# EAGLE design apu_mega_shield_integradted (EAGLE 6.5.0)

## Sheet 1 of 2
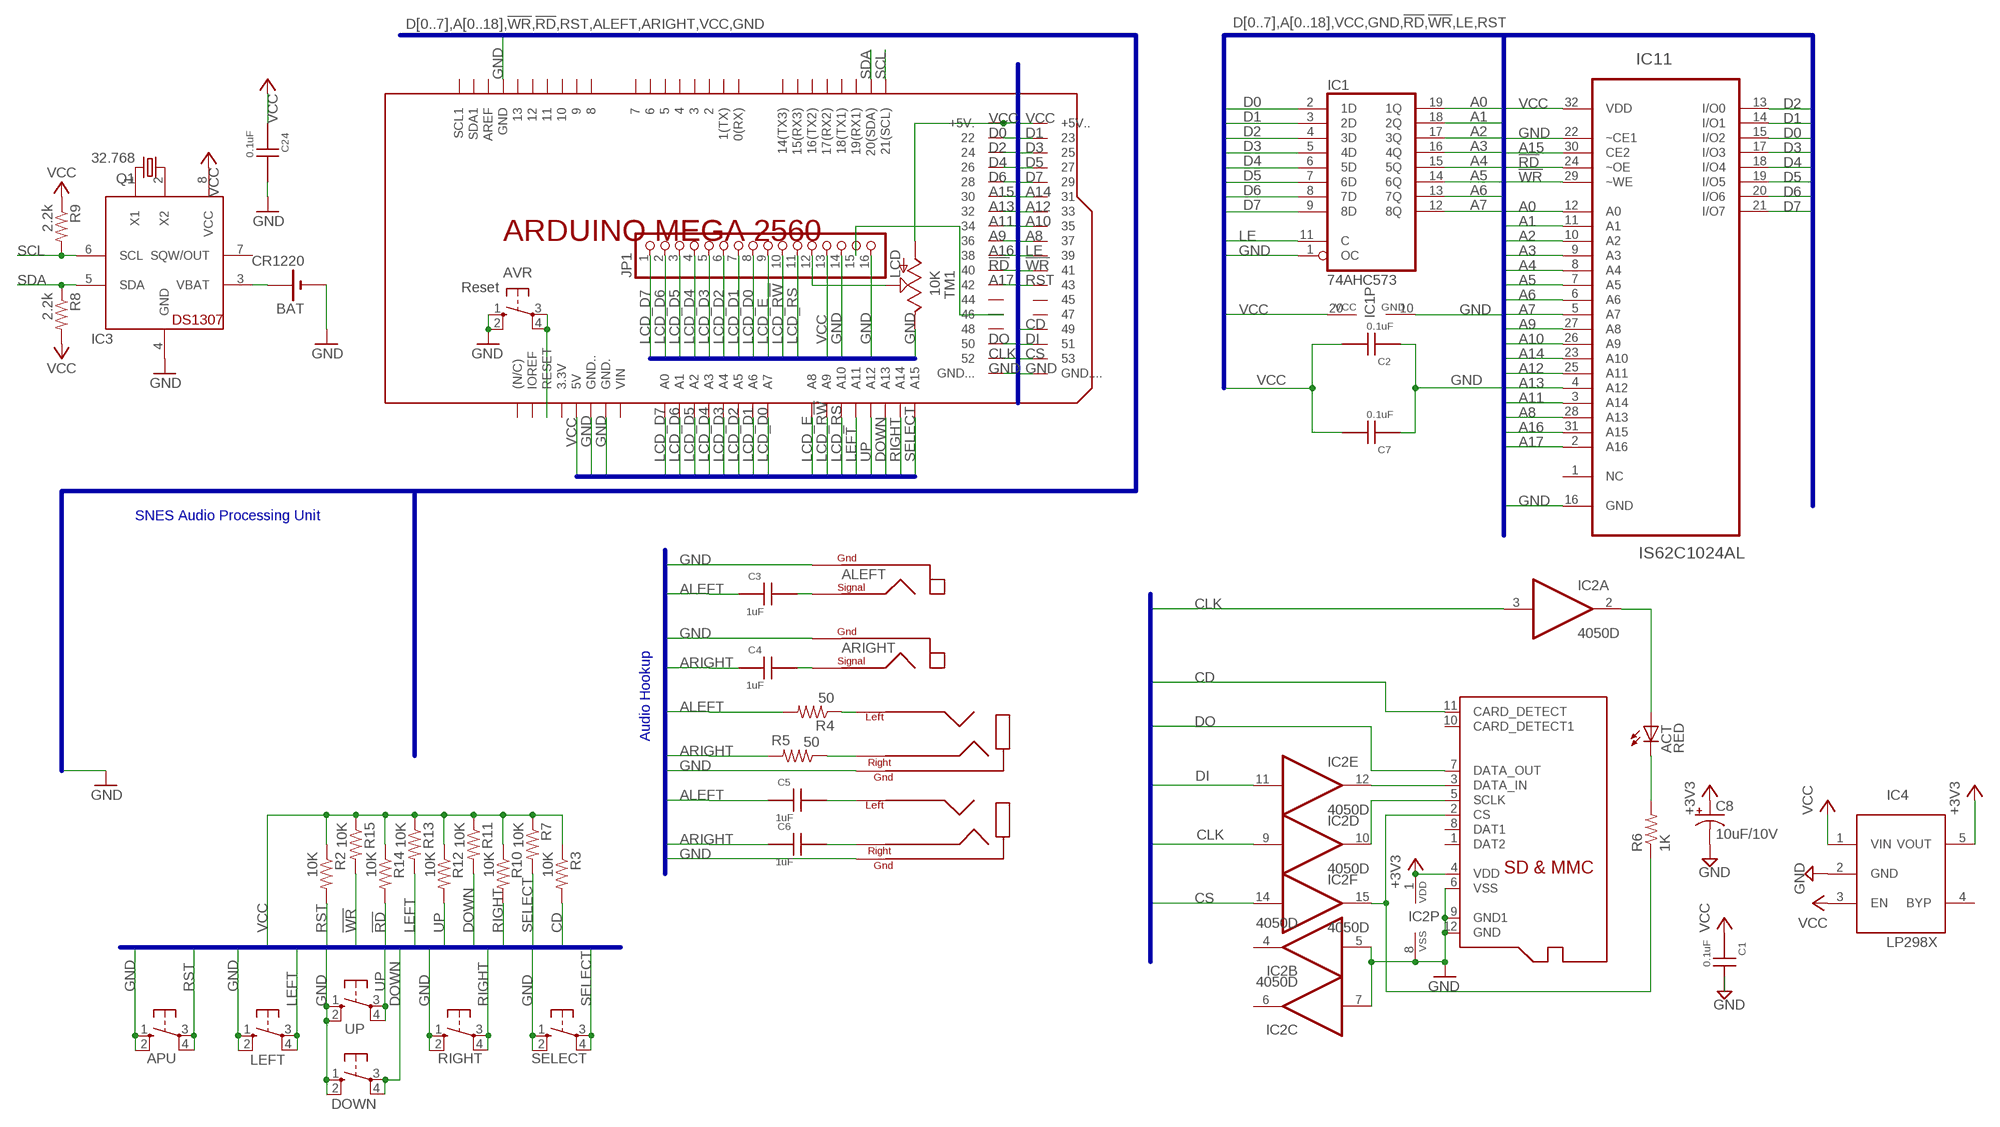
[diagram p0: schematic, sheet 1]

### Parts
ACT  RED  LEDCHIP-LED0805  [CHIP-LED0805]
APU  Reset  10-XX  [B3F-10XX]
AVR  Reset  10-XX  [B3F-10XX]
BAT  CR1220  CR1220SMT  [CR1220-SMD]
C1  0.1uF  C0805  [C0805]
C2  0.1uF  C0805  [C0805]
C3  1uF  C0805  [C0805]
C4  1uF  C0805  [C0805]
C5  1uF  C0805  [C0805]
C6  1uF  C0805  [C0805]
C7  0.1uF  C0805  [C0805]
C8  10uF/10V  CPOL-USA/3216-18R  [A/3216-18R]
C24  0.1uF  C0805  [C0805]
DOWN  DOWN  10-XX  [B3F-10XX]
IC1  74AHC573  74HCT573D  [SO20W]
IC2  4050D  [SO16]
IC3  DS1307  DS1307SMT  [SO-08]
IC4  LP298XS  [SOT23-5L]
IC11  IS62C1024AL  IS62C1024AL-35QLI  [SOIC127P1412X305-32N]
JP1  LCD  PINHD-1X16  [1X16]
LEFT  LEFT  10-XX  [B3F-10XX]
Q1  32.768  CRYTALSMD  [SMD]
R2  10K  R-US_R0805  [R0805]
R3  10K  R-US_R0805  [R0805]
R4  50  R-US_R0805  [R0805]
R5  50  R-US_R0805  [R0805]
R6  1K  R-US_R0805  [R0805]
R7  10K  R-US_R0805  [R0805]
R8  2.2k  R-US_R0805  [R0805]
R9  2.2k  R-US_R0805  [R0805]
R10  10K  R-US_R0805  [R0805]
R11  10K  R-US_R0805  [R0805]
R12  10K  R-US_R0805  [R0805]
R13  10K  R-US_R0805  [R0805]
R14  10K  R-US_R0805  [R0805]
R15  10K  R-US_R0805  [R0805]
RIGHT  RIGHT  10-XX  [B3F-10XX]
SELECT  SELECT  10-XX  [B3F-10XX]
TM1  10K  TRIM_US-CA6H  [CA6H]
U$2  HEADPHONE  [SJ1-3533N]
U$3  HEADPHONE  [SJ1-3533N]
U$4  RCA  [RCJ-01X]
U$5  RCA  [RCJ-01X]
U$6  ARDUINO_MEGA_2560_LITENO_LABELS  [ARDUINO_MEGA2560_LITE_NO_LABELS]
UP  UP  10-XX  [B3F-10XX]
X1  MICROSDMOLEX  [MICROSD-1]

### Nets
!RD: IC11.24(~OE) R14.2 U$6.40 ; also sheet 2
!WR: IC11.29(~WE) R15.2 U$6.41 ; also sheet 2
+3V3 [supply]: C8.+ IC2.1(P:VDD) IC4.5(VOUT) X1.4(VDD)
A0: IC1.19(1Q) IC11.12(A0)
A1: IC1.18(2Q) IC11.11(A1)
A2: IC1.17(3Q) IC11.10(A2)
A3: IC1.16(4Q) IC11.9(A3)
A4: IC1.15(5Q) IC11.8(A4)
A5: IC1.14(6Q) IC11.7(A5)
A6: IC1.13(7Q) IC11.6(A6)
A7: IC1.12(8Q) IC11.5(A7)
A8: IC11.28(A13) U$6.37
A9: IC11.27(A8) U$6.36
A10: IC11.26(A9) U$6.35 ; also sheet 2
A11: IC11.3(A14) U$6.34 ; also sheet 2
A12: IC11.25(A11) U$6.33
A13: IC11.4(A12) U$6.32
A14: IC11.23(A10) U$6.31
A15: IC11.30(CE2) U$6.30 ; also sheet 2
A16: IC11.31(A15) U$6.38
A17: IC11.2(A16) U$6.42
ALEFT [audio]: C3.1 C5.1 R4.2 ; also sheet 2
ARIGHT [audio]: C4.1 C6.1 R5.2 ; also sheet 2
BUF_CLK: IC2.10(D:O) X1.5(SCLK)
BUF_CS: IC2.15(F:O) R6.1 X1.2(CS)
BUF_DI: IC2.12(E:O) X1.3(DATA_IN)
BUF_LED: ACT.A IC2.2(A:O)
CD: R3.2 U$6.49 X1.11(CARD_DETECT)
CLK: IC2.3(A:I) IC2.9(D:I) U$6.52
CS: IC2.14(F:I) U$6.53
D0: IC1.2(1D) IC11.15(I/O2) U$6.22 ; also sheet 2
D1: IC1.3(2D) IC11.14(I/O1) U$6.23 ; also sheet 2
D2: IC1.4(3D) IC11.13(I/O0) U$6.24 ; also sheet 2
D3: IC1.5(4D) IC11.17(I/O3) U$6.25 ; also sheet 2
D4: IC1.6(5D) IC11.18(I/O4) U$6.26 ; also sheet 2
D5: IC1.7(6D) IC11.19(I/O5) U$6.27 ; also sheet 2
D6: IC1.8(7D) IC11.20(I/O6) U$6.28 ; also sheet 2
D7: IC1.9(8D) IC11.21(I/O7) U$6.29 ; also sheet 2
DI: IC2.11(E:I) U$6.51
DO: U$6.50 X1.7(DATA_OUT)
DOWN: DOWN.3(P) DOWN.4(P1) R11.2 U$6.A13
GND [supply]: APU.1(S) APU.2(S1) AVR.1(S) AVR.2(S1) BAT.- C1.2 C2.1 C7.1 C8.- C24.2 DOWN.1(S) DOWN.2(S1) IC1.1(OC) IC1.10(GND) IC2.5(B:I) IC2.7(C:I) IC2.8(P:VSS) IC3.4(GND) IC4.2(GND) IC11.16(GND) IC11.22(~CE1) JP1.14 JP1.16 LEFT.1(S) LEFT.2(S1) RIGHT.1(S) RIGHT.2(S1) SELECT.1(S) SELECT.2(S1) TM1.E U$2.GND U$3.GND U$4.PGND1 U$4.PGND2 U$4.PGND3 U$5.PGND1 U$5.PGND2 U$5.PGND3 U$6.GND U$6.GND. U$6.GND.. U$6.GND... U$6.GND.... UP.1(S) UP.2(S1) X1.6(VSS) X1.9(GND1) X1.12(GND) ; also sheet 2
LCD_D0: JP1.8 U$6.A7
LCD_D1: JP1.7 U$6.A6
LCD_D2: JP1.6 U$6.A5
LCD_D3: JP1.5 U$6.A4
LCD_D4: JP1.4 U$6.A3
LCD_D5: JP1.3 U$6.A2
LCD_D6: JP1.2 U$6.A1
LCD_D7: JP1.1 U$6.A0
LCD_E: JP1.9 U$6.A8
LCD_R!W: JP1.10 U$6.A9
LCD_RS: JP1.11 U$6.A10
LE: IC1.11(C) U$6.39
LEFT: LEFT.3(P) LEFT.4(P1) R13.2 U$6.A11
N$1: AVR.3(P) AVR.4(P1) U$6.RESET
N$2 [audio]: C3.2 U$4.PSIG
N$3 [audio]: C4.2 U$5.PSIG
N$4 [audio]: C5.2 U$3.LEFT
N$8 [audio]: C6.2 U$3.RIGHT
N$9 [audio]: R4.1 U$2.LEFT
N$10 [audio]: R5.1 U$2.RIGHT
N$11: ACT.C R6.2
N$13 [supply]: JP1.12 TM1.S
N$15: BAT.+$1(+) BAT.+$2(+) IC3.3(VBAT)
N$21: IC3.1(X1) Q1.2
N$22: IC3.2(X2) Q1.1
PWM: JP1.15 U$6.46
RIGHT: R10.2 RIGHT.3(P) RIGHT.4(P1) U$6.A14
RST: APU.3(P) APU.4(P1) R2.2 U$6.43 ; also sheet 2
SCL: IC3.6(SCL) R9.2 U$6.21(21(SCL))
SDA: IC3.5(SDA) R8.1 U$6.20(20(SDA))
SELECT: R7.2 SELECT.3(P) SELECT.4(P1) U$6.A15
UP: R12.2 U$6.A12 UP.3(P) UP.4(P1)
VCC [supply]: C1.1 C2.2 C7.2 C24.1 IC1.20(VCC) IC3.8(VCC) IC4.1(VIN) IC4.3(EN) IC11.32(VDD) JP1.13 R2.1 R3.1 R7.1 R8.2 R9.1 R10.1 R11.1 R12.1 R13.1 R14.1 R15.1 TM1.A U$6.5V U$6.5V.(+5V.) U$6.5V..(+5V..) ; also sheet 2
Unconnected: IC2.4(B:O) IC2.6(C:O) IC3.7(SQW/OUT) IC4.4(BYP) IC11.1(NC) U$6.0(0(RX)) U$6.1(1(TX)) U$6.2 U$6.3 U$6.3.3V U$6.4 U$6.5 U$6.6 U$6.7 U$6.8 U$6.9 U$6.10 U$6.11 U$6.12 U$6.13 U$6.14(14(TX3)) U$6.15(15(RX3)) U$6.16(16(TX2)) U$6.17(17(RX2)) U$6.18(18(TX1)) U$6.19(19(RX1)) U$6.44 U$6.45 U$6.47 U$6.48 U$6.AREF U$6.I/OREF(IOREF) U$6.N/C((N/C)) U$6.SCL1 U$6.SDA1 U$6.VIN X1.1(DAT2) X1.8(DAT1) X1.10(CARD_DETECT1)

### Buses
D[0..7],A[0..18],VCC,GND,!RD,!WR,LE,RST
D[0..7],A[0..18],!WR,!RD,RST,ALEFT,ARIGHT,VCC,GND
D[0..7],A[0..18],VCC,GND,!RD,!WR,LE,CD,DO,DI,CLK,CS
D[0..7],A[0..18],VCC,GND,!RD,!WR,LE,CD,DO,DI,CLK,CS,RST
D[0..7],A[0..1],WR,RD,RST,ALEFT,ARIGHT,GND
RST,!WR,!RD,UP,DOWN,LEFT,RIGHT,SELECT,VCC,GND,LCD_D[0..7],LCD_E,LCD_R!W,LCD_RS
RST,!WR,!RD,UP,DOWN,LEFT,RIGHT,SELECT,VCC,GND,CD

### Notes on the sheet
- SNES Audio Processing Unit
- Audio Hookup

## Sheet 2 of 2
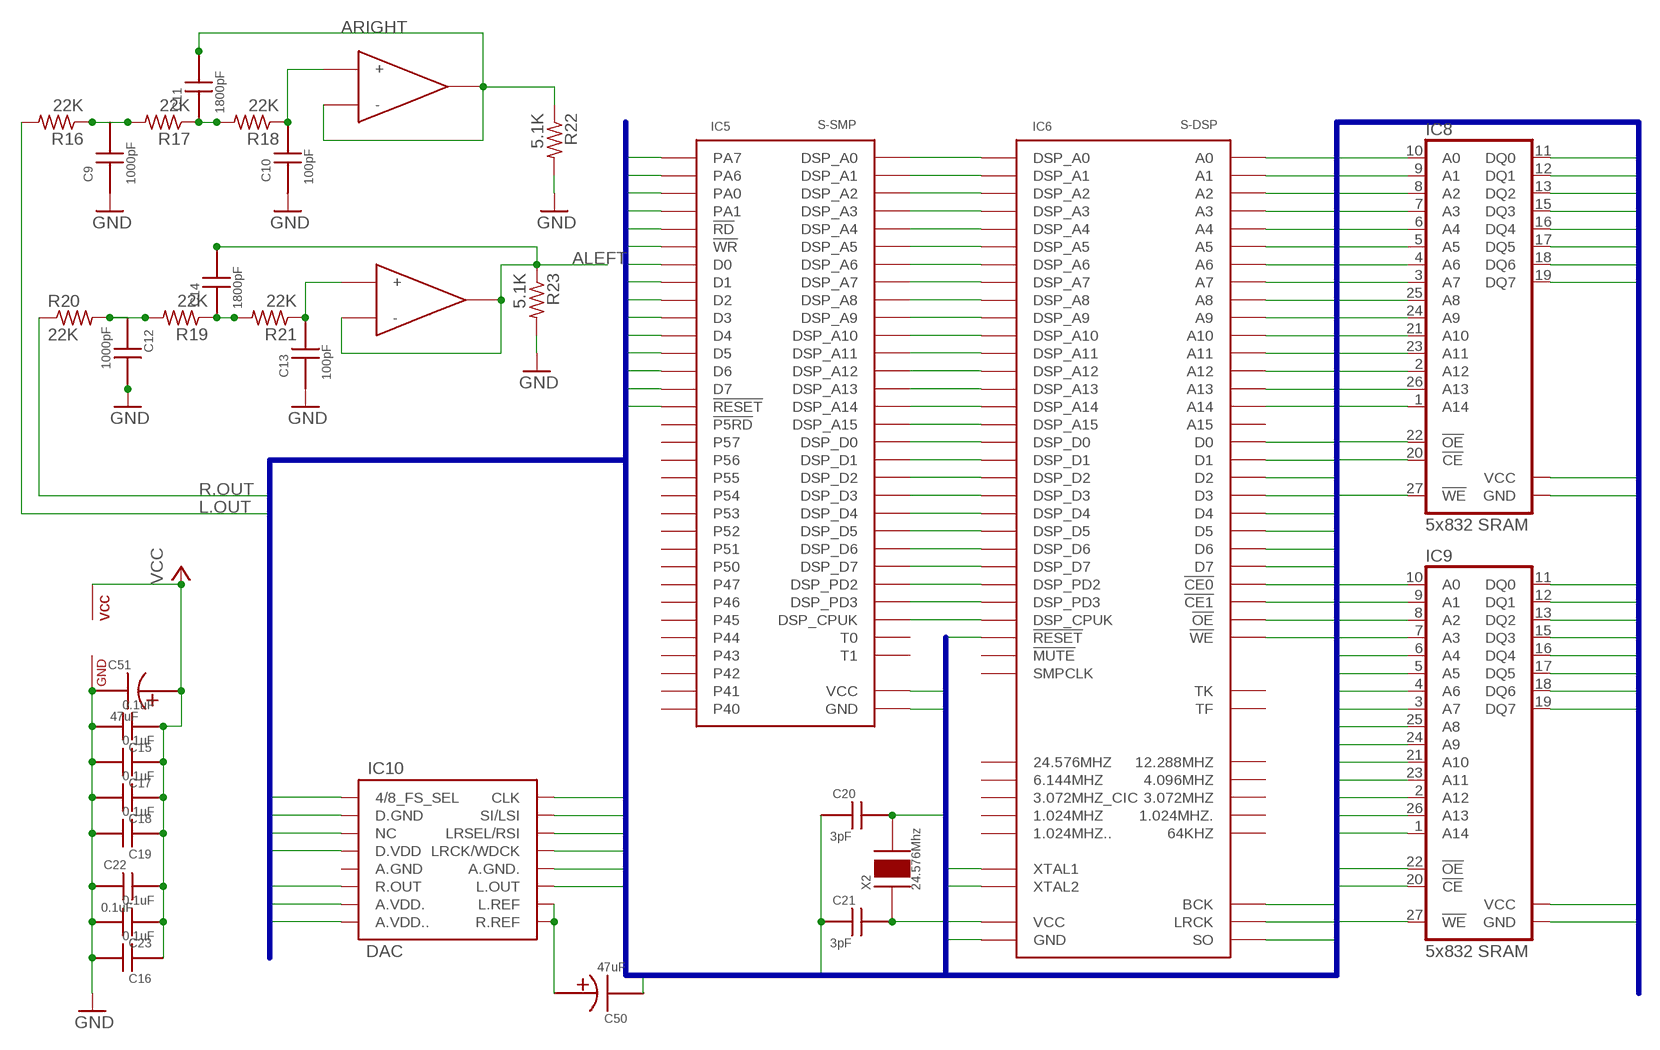
[diagram p1: schematic, sheet 2]

### Parts
C9  1000pF  C0805  [C0805]
C10  100pF  C0805  [C0805]
C11  1800pF  C0805  [C0805]
C12  1000pF  C0805  [C0805]
C13  100pF  C0805  [C0805]
C14  1800pF  C0805  [C0805]
C15  0.1uF  C0805  [C0805]
C16  0.1uF  C0805  [C0805]
C17  0.1uF  C0805  [C0805]
C18  0.1uF  C0805  [C0805]
C19  0.1uF  C0805  [C0805]
C20  3pF  C0805  [C0805]
C21  3pF  C0805  [C0805]
C22  0.1uF  C0805  [C0805]
C23  0.1uF  C0805  [C0805]
C50  47uF  CAPACITOR  [TT5D6]
C51  47uF  CAPACITOR  [TT5D6]
IC5  S-SMP  [QFP64_SOT319]
IC6  S-DSP  [QFP80_SOT318]
IC7  LM2904  [SO-08]
IC8  5x832 SRAM  SRAM  [SO28X]
IC9  5x832 SRAM  SRAM  [SO28X]
IC10  DAC  UPD6376  [SO16W]
R16  22K  R-US_R0805  [R0805]
R17  22K  R-US_R0805  [R0805]
R18  22K  R-US_R0805  [R0805]
R19  22K  R-US_R0805  [R0805]
R20  22K  R-US_R0805  [R0805]
R21  22K  R-US_R0805  [R0805]
R22  5.1K  R-US_R0805  [R0805]
R23  5.1K  R-US_R0805  [R0805]
X2  24.576Mhz  CRYSTAL  [QS]

### Nets
!CE0: IC6.28(!CE0) IC8.20(!CE)
!CE1: IC6.27(!CE1) IC9.20(!CE)
!OE: IC6.30(!OE) IC8.22(!OE) IC9.22(!OE)
!RD: IC5.46(!RD) ; also sheet 1
!WE: IC6.36(!WE) IC8.27(!WE) IC9.27(!WE)
!WR: IC5.47(!WR) ; also sheet 1
A10: IC5.49(PA0) ; also sheet 1
A11: IC5.48(PA1) ; also sheet 1
A15: IC5.51(PA7) ; also sheet 1
A18: IC6.9(A0) IC8.10(A0) IC9.10(A0)
A19: IC6.10(A1) IC8.9(A1) IC9.9(A1)
A20: IC6.11(A2) IC8.8(A2) IC9.8(A2)
A21: IC6.13(A3) IC8.7(A3) IC9.7(A3)
A22: IC6.14(A4) IC8.6(A4) IC9.6(A4)
A23: IC6.15(A5) IC8.5(A5) IC9.5(A5)
A24: IC6.16(A6) IC8.4(A6) IC9.4(A6)
A25: IC6.17(A7) IC8.3(A7) IC9.3(A7)
A26: IC6.34(A8) IC8.25(A8) IC9.25(A8)
A27: IC6.32(A9) IC8.24(A9) IC9.24(A9)
A28: IC6.29(A10) IC8.21(A10) IC9.21(A10)
A29: IC6.31(A11) IC8.23(A11) IC9.23(A11)
A30: IC6.18(A12) IC8.2(A12) IC9.2(A12)
A31: IC6.35(A13) IC8.26(A13) IC9.26(A13)
A32: IC6.19(A14) IC8.1(A14) IC9.1(A14)
A.REF [supply]: C50.+ IC10.9(R.REF) IC10.10(L.REF)
ALEFT [audio]: C14.2 IC7.6(-) IC7.7(OUT) R23.1 ; also sheet 1
ARIGHT [audio]: C11.2 IC7.1(OUT) IC7.2(-) R22.1 ; also sheet 1
BCK: IC6.42(BCK) IC10.16(CLK)
D0: IC5.45(D0) ; also sheet 1
D1: IC5.44(D1) ; also sheet 1
D2: IC5.43(D2) ; also sheet 1
D3: IC5.42(D3) ; also sheet 1
D4: IC5.41(D4) ; also sheet 1
D5: IC5.40(D5) ; also sheet 1
D6: IC5.39(D6) ; also sheet 1
D7: IC5.38(D7) ; also sheet 1
D8: IC6.8(D0) IC8.11(DQ0) IC9.11(DQ0)
D9: IC6.7(D1) IC8.12(DQ1) IC9.12(DQ1)
D10: IC6.6(D2) IC8.13(DQ2) IC9.13(DQ2)
D11: IC6.22(D3) IC8.15(DQ3) IC9.15(DQ3)
D12: IC6.23(D4) IC8.16(DQ4) IC9.16(DQ4)
D13: IC6.24(D5) IC8.17(DQ5) IC9.17(DQ5)
D14: IC6.25(D6) IC8.18(DQ6) IC9.18(DQ6)
D15: IC6.26(D7) IC8.19(DQ7) IC9.19(DQ7)
DSP_A0: IC5.5(DSP_A0) IC6.60(DSP_A0)
DSP_A1: IC5.4(DSP_A1) IC6.61(DSP_A1)
DSP_A2: IC5.3(DSP_A2) IC6.62(DSP_A2)
DSP_A3: IC5.2(DSP_A3) IC6.63(DSP_A3)
DSP_A4: IC5.1(DSP_A4) IC6.64(DSP_A4)
DSP_A5: IC5.64(DSP_A5) IC6.65(DSP_A5)
DSP_A6: IC5.63(DSP_A6) IC6.66(DSP_A6)
DSP_A7: IC5.62(DSP_A7) IC6.67(DSP_A7)
DSP_A8: IC5.61(DSP_A8) IC6.68(DSP_A8)
DSP_A9: IC5.60(DSP_A9) IC6.69(DSP_A9)
DSP_A10: IC5.59(DSP_A10) IC6.70(DSP_A10)
DSP_A11: IC5.56(DSP_A11) IC6.71(DSP_A11)
DSP_A12: IC5.55(DSP_A12) IC6.72(DSP_A12)
DSP_A13: IC5.54(DSP_A13) IC6.74(DSP_A13)
DSP_A14: IC5.53(DSP_A14) IC6.75(DSP_A14)
DSP_A15: IC5.52(DSP_A15) IC6.76(DSP_A15)
DSP_CPUK: IC5.16(DSP_CPUK) IC6.48(DSP_CPUK)
DSP_D0: IC5.13(DSP_D0) IC6.51(DSP_D0)
DSP_D1: IC5.12(DSP_D1) IC6.53(DSP_D1)
DSP_D2: IC5.11(DSP_D2) IC6.54(DSP_D2)
DSP_D3: IC5.10(DSP_D3) IC6.55(DSP_D3)
DSP_D4: IC5.9(DSP_D4) IC6.56(DSP_D4)
DSP_D5: IC5.8(DSP_D5) IC6.57(DSP_D5)
DSP_D6: IC5.7(DSP_D6) IC6.58(DSP_D6)
DSP_D7: IC5.6(DSP_D7) IC6.59(DSP_D7)
DSP_PD2: IC5.15(DSP_PD2) IC6.49(DSP_PD2)
DSP_PD3: IC5.14(DSP_PD3) IC6.50(DSP_PD3)
GND [supply]: C9.1 C10.1 C12.2 C13.1 C15.2 C16.2 C17.2 C18.2 C19.2 C20.1 C21.1 C22.1 C23.2 C50.- C51.- IC5.26(GND) IC5.58(GND) IC6.12(GND) IC6.52(GND) IC7.4(SUPPLY:GND) IC8.14(GND) IC9.14(GND) IC10.1(4/8_FS_SEL) IC10.2(D.GND) IC10.12(A.GND.) IC10.14(LRSEL/RSI) R22.2 R23.2 ; also sheet 1
L1 [audio]: C12.1 R19.2 R20.2
L2 [audio]: C14.1 R19.1 R21.2
L3 [audio]: C13.2 IC7.5(+) R21.1
L.OUT [audio]: IC10.11(L.OUT) R16.2
LRCK: IC6.43(LRCK) IC10.13(LRCK/WDCK)
R1 [audio]: C9.2 R16.1 R17.2
R2 [audio]: C11.1 R17.1 R18.2
R3 [audio]: C10.2 IC7.3(+) R18.1
R.OUT [audio]: IC10.6(R.OUT) R20.1
RST: IC5.37(!RESET) IC6.47(!RESET) ; also sheet 1
SO: IC6.44(SO) IC10.15(SI/LSI)
VCC [supply]: C15.1 C16.1 C17.1 C18.1 C19.1 C22.2 C23.1 C51.+ IC5.50(PA6) IC5.57(VCC) IC6.33(VCC) IC6.73(VCC) IC7.8(SUPPLY:VCC) IC8.28(VCC) IC9.28(VCC) IC10.3(NC) IC10.4(D.VDD) IC10.7(A.VDD.) IC10.8(A.VDD..) ; also sheet 1
XTAL1: C21.2 IC6.45(XTAL1) X2.1
XTAL2: C20.2 IC6.46(XTAL2) X2.2
Unconnected: IC5.17(!P5RD) IC5.18(P57) IC5.19(P56) IC5.20(P55) IC5.21(P54) IC5.22(P53) IC5.23(P52) IC5.24(P51) IC5.25(P50) IC5.27(P47) IC5.28(P46) IC5.29(P45) IC5.30(P44) IC5.31(P43) IC5.32(P42) IC5.33(P41) IC5.34(P40) IC5.35(T1) IC5.36(T0) IC6.1(4.096MHZ) IC6.2(3.072MHZ) IC6.3(1.024MHZ) IC6.4(1.024MHZ.) IC6.5(1.024MHZ..) IC6.20(A15) IC6.37(TF) IC6.38(TK) IC6.39(!MUTE) IC6.40(64KHZ) IC6.41(3.072MHZ_CIC) IC6.77(24.576MHZ) IC6.78(SMPCLK) IC6.79(12.288MHZ) IC6.80(6.144MHZ) IC10.5(A.GND)

### Buses
PA[0..7],PD[0..7],!RD,!WR,RST,!MUTE,SMPCLK,LEFT,RIGHT,GND,VCC,XTAL1,XTAL2,A[0..32],D[0..15],!CE0,!CE1,!OE,!WE,L.OUT,R.OUT,BCK,LRCK,SO,AVCC

## Library data of the parts
ACT = adafruit:LED: LED OSRAM: - CHIPLED LG R971, LG N971, LY N971, LG Q971, LY Q971, LO R971, LY R971 LH N974, LH R974 LS Q976, LO Q976, LY Q976 LO Q996 - Hyper CHIPLED LW Q18S LB Q993, LB Q99A, LB R99A - SideLED LS A670, LO A670, LY A670, LG A670, LP A670 LB A673, LV A673, LT A673, LW A673 LH A674 LY A675 LS A676, LA A676, LO A676, LY A676, LW A676 LS A679, LY A679, LG A679 - Hyper Micro SIDELED® LS Y876, LA Y876, LO Y876, LY Y876 LT Y87S - SmartLED LW L88C, LW L88S LB L89C, LB L89S, LG L890 LS L89K, LO L89K, LY L89K LS L896, LA L896, LO L896, LY L896 - TOPLED LS T670, LO T670, LY T670, LG T670, LP T670 LSG T670, LSP T670, LSY T670, LOP T670, LYG T670 LG T671, LOG T671, LSG T671 LB T673, LV T673, LT T673, LW T673 LH T674 LS T676, LA T676, LO T676, LY T676, LB T676, LH T676, LSB T676, LW T676 LB T67C, LV T67C, LT T67C, LS T67K, LO T67K, LY T67K, LW E67C LS E67B, LA E67B, LO E67B, LY E67B, LB E67C, LV E67C, LT E67C LW T67C LS T679, LY T679, LG T679 LS T770, LO T770, LY T770, LG T770, LP T770 LB T773, LV T773, LT T773, LW T773 LH T774 LS E675, LA E675, LY E675, LS T675 LS T776, LA T776, LO T776, LY T776, LB T776 LHGB T686 LT T68C, LB T68C - Hyper Mini TOPLED® LB M676 - Mini TOPLED Santana® LG M470 LS M47K, LO M47K, LY M47K Source: http://www.osram.convergy.de/
APU AVR DOWN LEFT RIGHT SELECT UP = switch-omron:10-XX: OMRON SWITCH
BAT = adafruit:CR1220: CR1216/CR1220/CR1225 12mm 3V lithium coin cell Great for battery packup. Both SMT and THM holders. Note the THM package has the ground pads on both sides of the PCB so that the masks are the same - this reduces the cost
C1-C7 C9-C24 = apu_pcb:C0805
C8 = adafruit:CPOL-US: POLARIZED CAPACITOR, American symbol
C50 C51 = apu_pcb:CAPACITOR
IC1 = 74xx-eu:74*573: 8-bit D latch BUS DRIVER
IC2 = 40xx:4050: Hex non-inverting BUFFER
IC3 = adafruit:DS1307: DS1307 Real time clock (RTC) with battery backup ability. Talk to it via i2c
IC4 = adafruit:LP298X
IC5 = apu_pcb:S-SMP
IC6 = apu_pcb:S-DSP
IC7 = apu_pcb:LM2904
IC8 IC9 = apu_pcb:SRAM
IC10 = apu_pcb:UPD6376
IC11 = ISSI_By_element14_Batch_1:IS62C1024AL-35QLI: STATIC RAM; MPN: IS62C1024AL-35QLI; OC_FARNELL: 1869973; OC_NEWARK: 43M5399; PACKAGE: SOIC-32; SUPPLIER: INTEGRATED SILICON SOLUTION (ISSI)
JP1 = pinhead:PINHD-1X16: PIN HEADER
Q1 = crystal:CRYTAL: CRYSTAL
R2-R23 = adafruit:R-US_: RESISTOR, American symbol
TM1 = pot:TRIM_US-: POTENTIOMETER
U$2 U$3 = caitsith2:HEADPHONE
U$4 U$5 = caitsith2:RCA
U$6 = E14_Arduino_revB:ARDUINO_MEGA_2560_LITE
X1 = adafruit:MICROSD: Micro-SD / Transflash card holder with SPI pinout For the 3M # 2908-05WB-MG and/or 4UCON #19656 push-push type
X2 = apu_pcb:CRYSTAL

## Net classes
0 default: width 0.152 mm, clearance 0.152 mm
1 supply: width 0.305 mm, clearance 0.152 mm
2 audio: width 0.305 mm, clearance 0.152 mm

## Board
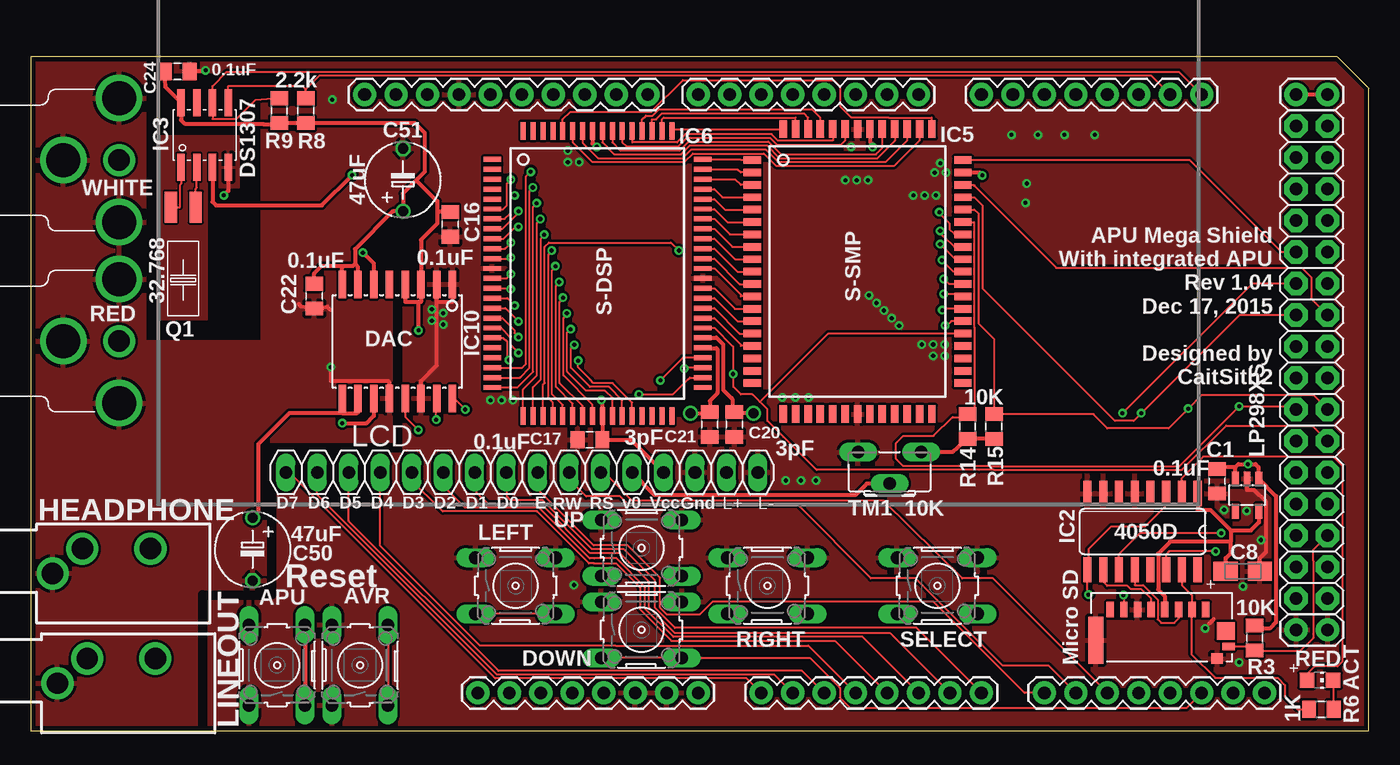
[diagram p2: board, top side]
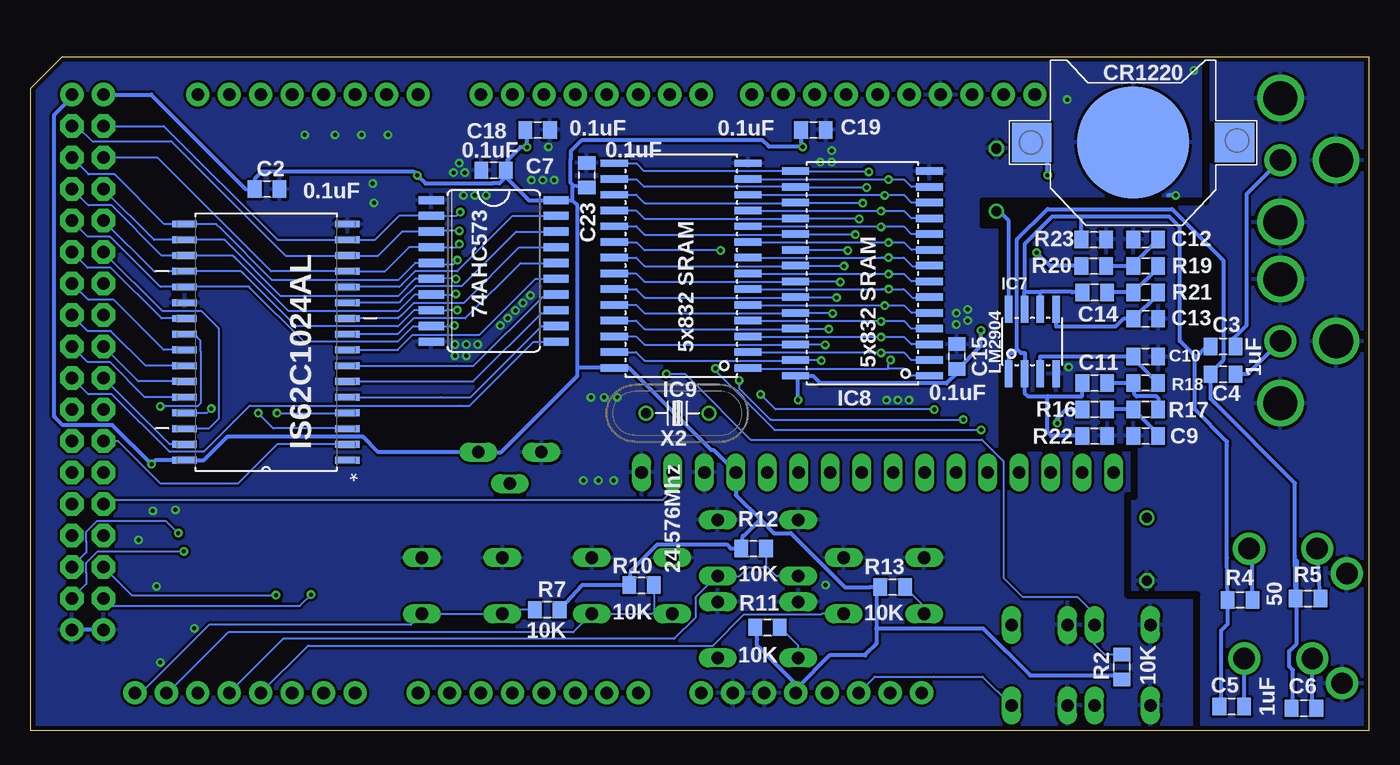
[diagram p3: board, bottom side, seen from below]

Size 107.95 x 54.36 mm. Coordinates in mm from the lower left corner, seen from the top.
Outline: 0,0 107.95,0 107.95,50.8 107.95,51.82 105.41,54.36 104.14,54.36 0,54.36 0,0
Copper layers (1*16): Top 0.0356mm / dielectric 1.5011mm / Bottom 0.0356mm
Design rules "oshpark-2layer": minimum track width 6mil, minimum drill 13mil, track to track 6mil, track to pad 6mil, pad to pad 6mil, via to via 6mil, smd to smd 6mil, copper to edge 15mil, drill to drill 6mil, minimum pad ring 7mil, minimum via ring 7mil, stop-mask expansion 4mil, vias tented up to drill 0mil, thermal gap 10mil
tRestrict: 20 lines
bRestrict: 24 lines

### Footprints (pad centres in the part's own frame; a part is rotated, then mirrored left to right if it is on the bottom)
CHIP-LED0805 = smd 1.2 x 1.2: A 0,-1.05; C 0,1.05
B3F-10XX = drill 1.016 long: 1 -3.251,2.261; 2 3.251,2.261; 3 -3.251,-2.261; 4 3.251,-2.261
CR1220-SMD = smd 3.2 x 3.2: +$1 -8.2,0; +$2 8.2,0 | smd 9 x 9: - 0,0
C0805 = smd 1.1 x 1.4: 1 -1,0; 2 1,0
A/3216-18R = smd 1.95 x 1.5: + 1.375,0; - -1.375,0
TT5D6 = drill 0.813: + -2.54,0 | drill 0.813 octagon: - 2.54,0
SO20W = smd 0.66 x 2.032: 1 -5.715,-5.029; 2 -4.445,-5.029; 3 -3.175,-5.029; 4 -1.905,-5.029; 5 -0.635,-5.029; 6 0.635,-5.029; 7 1.905,-5.029; 8 3.175,-5.029; 9 4.445,-5.029; 10 5.715,-5.029; 11 5.715,5.029; 12 4.445,5.029; 13 3.175,5.029; 14 1.905,5.029; 15 0.635,5.029; 16 -0.635,5.029; 17 -1.905,5.029; 18 -3.175,5.029; 19 -4.445,5.029; 20 -5.715,5.029
SO16 = smd 0.66 x 2.032: 1 -4.445,-3.073; 2 -3.175,-3.073; 3 -1.905,-3.073; 4 -0.635,-3.073; 5 0.635,-3.073; 6 1.905,-3.073; 7 3.175,-3.073; 8 4.445,-3.073; 9 4.445,3.073; 10 3.175,3.073; 11 1.905,3.073; 12 0.635,3.073; 13 -0.635,3.073; 14 -1.905,3.073; 15 -3.175,3.073; 16 -4.445,3.073
SO-08 = smd 0.6 x 2.2: 1 -1.905,-2.6; 2 -0.635,-2.6; 3 0.635,-2.6; 4 1.905,-2.6; 5 1.905,2.6; 6 0.635,2.6; 7 -0.635,2.6; 8 -1.905,2.6
SOT23-5L = smd 0.55 x 1.2: 1 -0.95,-1.3; 2 0,-1.3; 3 0.95,-1.3; 4 0.95,1.3; 5 -0.95,1.3
QFP64_SOT319 = smd 0.6 x 1.4: 1 -9,-8.5; 2 -8,-8.5; 3 -7,-8.5; 4 -6,-8.5; 5 -5,-8.5; 6 -4,-8.5; 7 -3,-8.5; 8 -2,-8.5; 9 -1,-8.5; 10 0,-8.5; 11 1,-8.5; 12 2,-8.5; 13 3,-8.5; 14 4,-8.5; 15 5,-8.5; 16 6,-8.5; 17 7,-8.5; 18 8,-8.5; 19 9,-8.5; 33 9,8.5; 34 8,8.5; 35 7,8.5; 36 6,8.5; 37 5,8.5; 38 4,8.5; 39 3,8.5; 40 2,8.5; 41 1,8.5; 42 0,8.5; 43 -1,8.5; 44 -2,8.5; 45 -3,8.5; 46 -4,8.5; 47 -5,8.5; 48 -6,8.5; 49 -7,8.5; 50 -8,8.5; 51 -9,8.5 | smd 1.4 x 0.6: 20 11.5,-6; 21 11.5,-5; 22 11.5,-4; 23 11.5,-3; 24 11.5,-2; 25 11.5,-1; 26 11.5,0; 27 11.5,1; 28 11.5,2; 29 11.5,3; 30 11.5,4; 31 11.5,5; 32 11.5,6; 52 -11.5,6; 53 -11.5,5; 54 -11.5,4; 55 -11.5,3; 56 -11.5,2; 57 -11.5,1; 58 -11.5,0; 59 -11.5,-1; 60 -11.5,-2; 61 -11.5,-3; 62 -11.5,-4; 63 -11.5,-5; 64 -11.5,-6
QFP80_SOT318 = smd 0.4 x 1.4: 1 -9.2,-8.5; 2 -8.4,-8.5; 3 -7.6,-8.5; 4 -6.8,-8.5; 5 -6,-8.5; 6 -5.2,-8.5; 7 -4.4,-8.5; 8 -3.6,-8.5; 9 -2.8,-8.5; 10 -2,-8.5; 11 -1.2,-8.5; 12 -0.4,-8.5; 13 0.4,-8.5; 14 1.2,-8.5; 15 2,-8.5; 16 2.8,-8.5; 17 3.6,-8.5; 18 4.4,-8.5; 19 5.2,-8.5; 20 6,-8.5; 21 6.8,-8.5; 22 7.6,-8.5; 23 8.4,-8.5; 24 9.2,-8.5; 41 9.2,8.5; 42 8.4,8.5; 43 7.6,8.5; 44 6.8,8.5; 45 6,8.5; 46 5.2,8.5; 47 4.4,8.5; 48 3.6,8.5; 49 2.8,8.5; 50 2,8.5; 51 1.2,8.5; 52 0.4,8.5; 53 -0.4,8.5; 54 -1.2,8.5; 55 -2,8.5; 56 -2.8,8.5; 57 -3.6,8.5; 58 -4.4,8.5; 59 -5.2,8.5; 60 -6,8.5; 61 -6.8,8.5; 62 -7.6,8.5; 63 -8.4,8.5; 64 -9.2,8.5 | smd 1.4 x 0.4: 25 11.5,-6; 26 11.5,-5.2; 27 11.5,-4.4; 28 11.5,-3.6; 29 11.5,-2.8; 30 11.5,-2; 31 11.5,-1.2; 32 11.5,-0.4; 33 11.5,0.4; 34 11.5,1.2; 35 11.5,2; 36 11.5,2.8; 37 11.5,3.6; 38 11.5,4.4; 39 11.5,5.2; 40 11.5,6; 65 -11.5,6; 66 -11.5,5.2; 67 -11.5,4.4; 68 -11.5,3.6; 69 -11.5,2.8; 70 -11.5,2; 71 -11.5,1.2; 72 -11.5,0.4; 73 -11.5,-0.4; 74 -11.5,-1.2; 75 -11.5,-2; 76 -11.5,-2.8; 77 -11.5,-3.6; 78 -11.5,-4.4; 79 -11.5,-5.2; 80 -11.5,-6
SO28X = smd 0.6 x 2.2: 1 -8.255,-5.4; 2 -6.985,-5.4; 3 -5.715,-5.4; 4 -4.445,-5.4; 5 -3.175,-5.4; 6 -1.905,-5.4; 7 -0.635,-5.4; 8 0.635,-5.4; 9 1.905,-5.4; 10 3.175,-5.4; 11 4.445,-5.4; 12 5.715,-5.4; 13 6.985,-5.4; 14 8.255,-5.4; 15 8.255,5.4; 16 6.985,5.4; 17 5.715,5.4; 18 4.445,5.4; 19 3.175,5.4; 20 1.905,5.4; 21 0.635,5.4; 22 -0.635,5.4; 23 -1.905,5.4; 24 -3.175,5.4; 25 -4.445,5.4; 26 -5.715,5.4; 27 -6.985,5.4; 28 -8.255,5.4
SO16W = smd 0.6 x 2.2: 1 -4.445,-4.6; 2 -3.175,-4.6; 3 -1.905,-4.6; 4 -0.635,-4.6; 5 0.635,-4.6; 6 1.905,-4.6; 7 3.175,-4.6; 8 4.445,-4.6; 9 4.445,4.6; 10 3.175,4.6; 11 1.905,4.6; 12 0.635,4.6; 13 -0.635,4.6; 14 -1.905,4.6; 15 -3.175,4.6; 16 -4.445,4.6
SOIC127P1412X305-32N = smd 1.981 x 0.559: 1 -6.579,9.525; 2 -6.579,8.255; 3 -6.579,6.985; 4 -6.579,5.715; 5 -6.579,4.445; 6 -6.579,3.175; 7 -6.579,1.905; 8 -6.579,0.635; 9 -6.579,-0.635; 10 -6.579,-1.905; 11 -6.579,-3.175; 12 -6.579,-4.445; 13 -6.579,-5.715; 14 -6.579,-6.985; 15 -6.579,-8.255; 16 -6.579,-9.525; 17 6.579,-9.525; 18 6.579,-8.255; 19 6.579,-6.985; 20 6.579,-5.715; 21 6.579,-4.445; 22 6.579,-3.175; 23 6.579,-1.905; 24 6.579,-0.635; 25 6.579,0.635; 26 6.579,1.905; 27 6.579,3.175; 28 6.579,4.445; 29 6.579,5.715; 30 6.579,6.985; 31 6.579,8.255; 32 6.579,9.525
1X16 = drill 1.016 long: 1 -19.05,0; 2 -16.51,0; 3 -13.97,0; 4 -11.43,0; 5 -8.89,0; 6 -6.35,0; 7 -3.81,0; 8 -1.27,0; 9 1.27,0; 10 3.81,0; 11 6.35,0; 12 8.89,0; 13 11.43,0; 14 13.97,0; 15 16.51,0; 16 19.05,0
SMD = smd 2.5 x 1: 1 2.25,-1; 2 2.25,1
R0805 = smd 1.1 x 1.4: 1 -1,0; 2 1,0
CA6H = drill 1.016 long: A -2.54,0; E 2.54,0; S 0,2.54
SJ1-3533N = drill 1.727: GND -4.7,0; LEFT 3.2,2; RIGHT -2.3,2
RCJ-01X = drill 2.743: PGND1 0,5; PGND2 4.5,0; PGND3 0,-5 | drill 1.727: PSIG 0,0
ARDUINO_MEGA2560_LITE_NO_LABELS = drill 1.016 pad 1.88: 0 63.5,50.8; 1 60.96,50.8; 2 58.42,50.8; 3 55.88,50.8; 3.3V 35.56,2.54; 4 53.34,50.8; 5 50.8,50.8; 5V 38.1,2.54; 5V. 93.98,50.8; 5V.. 96.52,50.8; 6 48.26,50.8; 7 45.72,50.8; 8 41.656,50.8; 9 39.116,50.8; 10 36.576,50.8; 11 34.036,50.8; 12 31.496,50.8; 13 28.956,50.8; 14 68.58,50.8; 15 71.12,50.8; 16 73.66,50.8; 17 76.2,50.8; 18 78.74,50.8; 19 81.28,50.8; 20 83.82,50.8; 21 86.36,50.8; A0 50.8,2.54; A1 53.34,2.54; A2 55.88,2.54; A3 58.42,2.54; A4 60.96,2.54; A5 63.5,2.54; A6 66.04,2.54; A7 68.58,2.54; A8 73.66,2.54; A9 76.2,2.54; A10 78.74,2.54; A11 81.28,2.54; A12 83.82,2.54; A13 86.36,2.54; A14 88.9,2.54; A15 91.44,2.54; AREF 23.876,50.8; GND 26.416,50.8; GND. 43.18,2.54; GND.. 40.64,2.54; GND... 93.98,7.62; GND.... 96.52,7.62; I/OREF 30.48,2.54; N/C 27.94,2.54; RESET 33.02,2.54; SCL1 18.796,50.8; SDA1 21.336,50.8; VIN 45.72,2.54 | drill 1.016 pad 1.88 octagon: 22 93.98,48.26; 23 96.52,48.26; 24 93.98,45.72; 25 96.52,45.72; 26 93.98,43.18; 27 96.52,43.18; 28 93.98,40.64; 29 96.52,40.64; 30 93.98,38.1; 31 96.52,38.1; 32 93.98,35.56; 33 96.52,35.56; 34 93.98,33.02; 35 96.52,33.02; 36 93.98,30.48; 37 96.52,30.48; 38 93.98,27.94; 39 96.52,27.94; 40 93.98,25.4; 41 96.52,25.4; 42 93.98,22.86; 43 96.52,22.86; 44 93.98,20.32; 45 96.52,20.32; 46 93.98,17.78; 47 96.52,17.78; 48 93.98,15.24; 49 96.52,15.24; 50 93.98,12.7; 51 96.52,12.7; 52 93.98,10.16; 53 96.52,10.16
MICROSD-1 = smd 0.6 x 1.25: 1 8.85,4.175; 2 7.75,4.175; 3 6.65,4.175; 4 5.55,4.175; 5 4.45,4.175; 6 3.35,4.175; 7 2.25,4.175; 8 1.15,4.175 | smd 1.2 x 3.79: 9 0,1.695 | smd 1.45 x 1.4: 10 10.475,2.45 | smd 1 x 0.6: 11 10.7,1.2 | smd 0.95 x 0.85: 12 9.775,0.225
QS = drill 0.8: 1 -2.54,0; 2 2.54,0

### Placement (x,y rotation side)
ACT  104.04,4.06 270 top
APU  19.86,5.28 90 top
AVR  26.56,5.28 90 top
BAT  19,47.45 0 bottom
C1  95.73,20.12 270 top
C2  88.9,43.69 180 bottom
C3  11.73,30.99 0 bottom
C4  11.73,28.75 0 bottom
C5  11.04,1.94 0 bottom
C6  5.22,1.8 0 bottom
C7  70.61,45.21 0 bottom
C8  97.79,12.85 180 top
C9  17.98,23.77 0 bottom
C10  17.98,30.18 180 bottom
C11  22.1,28.04 180 bottom
C12  17.98,39.62 180 bottom
C13  17.98,33.22 180 bottom
C14  22.1,35.36 180 bottom
C15  33.22,30.18 90 bottom
C16  33.83,40.84 270 top
C17  45.11,23.47 180 top
C18  67.06,48.46 0 bottom
C19  44.81,48.46 0 bottom
C20  56.77,24.69 90 top
C21  54.79,24.69 90 top
C22  22.86,35.05 90 top
C23  63.09,44.81 90 bottom
C24  11.81,53.19 0 top
C50  17.88,14.63 270 top
C51  30.02,44.42 90 top
DOWN  49.28,8.13 0 top
IC1  70.61,37.08 270 bottom
IC2  89.71,16.05 180 top
IC3  14.02,48.06 0 top
IC4  98.15,19 180 top
IC5  66.71,37.03 270 top
IC6  45.72,36.88 270 top
IC7  27.13,31.39 0 bottom
IC8  40.84,36.88 90 bottom
IC9  55.47,37.52 90 bottom
IC10  29.57,31.39 180 top
IC11  88.98,31.34 180 bottom
JP1  39.62,20.83 0 top
LEFT  39.12,11.68 0 top
Q1  12.29,39.98 90 top
R2  19.91,5.13 90 bottom
R3  98.76,7.47 270 top
R4  10.36,10.54 180 bottom
R5  4.88,10.64 180 bottom
R6  104.14,1.73 0 top
R7  66.29,9.75 180 bottom
R8  22.17,50.01 270 top
R9  20.04,50.01 90 top
R10  58.67,11.73 0 bottom
R11  48.51,8.34 0 bottom
R12  49.63,14.69 0 bottom
R13  38.4,11.58 0 bottom
R14  75.59,24.54 90 top
R15  77.72,24.54 90 top
R16  22.1,25.91 180 bottom
R17  17.98,25.91 180 bottom
R18  17.98,28.04 180 bottom
R19  17.98,37.49 180 bottom
R20  22.17,37.49 0 bottom
R21  17.98,35.36 180 bottom
R22  22.1,23.77 0 bottom
R23  22.17,39.62 0 bottom
RIGHT  59.44,11.68 0 top
SELECT  73.15,11.68 0 top
TM1  69.29,22.47 180 top
U$2  6.44,12.67 0 top
U$3  6.84,3.82 0 top
U$4  7.11,46.02 180 top
U$5  7.11,31.42 180 top
U$6  8.13,0.51 0 top
UP  49.28,14.73 0 top
X1  85.95,5.59 0 top
X2  55.78,25.6 180 bottom

### Tracks (layer width: path | path; a pad name or v marks a point on that pad's centre or on a via)
!CE0  (via drill 0.33)
  Top 0.152: v42.02,38.73 41.76,38.39 41.76,26.82 42.12,26.46 IC6.28
  Bottom 0.152: v42.02,38.73 46.19,38.73 IC8.20
!CE1  (via drill 0.33)
  Top 0.152: IC6.27 41.32,27.91 41.45,28.04 41.45,39.03 41.8,39.37 51.65,39.37 v52.29,38.73
  Bottom 0.152: v52.29,38.73 58.42,38.73 59.05,39.37 60.82,39.37 IC9.20
!OE  (via drill 0.33)
  Top 0.152: IC6.30 43.72,26.38 42.37,27.74 42.37,35.83 v42.63,36.2
  Bottom 0.152: IC9.22 59.11,36.88 58.42,36.2 46.29,36.2 IC8.22 46.19,36.2 v42.63,36.2
!RD  (via drill 0.33 pad 0.69)
  Top 0.152: IC5.46 76.14,41.03 76.14,32.53 76.14,25.94 R14.2 75.5,25.3 74.37,25.3 72.85,23.77 70.41,23.77 69.8,23.16 69.8,21.95 70.41,21.34 77.42,21.34 92.71,21.34 92.71,21.35 v97.52,26.16 101.85,26.16 U$6.40
  Bottom 0.152: v97.52,26.16 94.5,26.16 94.26,26.41 94.26,30.61 94.26,31.47 94.79,32 95.53,32 IC11.24
!WE  (via drill 0.33)
  Top 0.152: IC6.36 48.52,26.46 46.94,28.04 45.41,28.04 45.11,28.35 44.16,29.3 v44.16,29.84
  Bottom 0.152: IC9.27 59.11,30.53 58.42,29.84 51.82,29.84 46.29,29.84 IC8.27 44.5,29.9 v44.16,29.84
!WR  (via drill 0.33 pad 0.69)
  Top 0.152: IC5.47 76.14,42.03 76.49,41.68 76.49,32.83 77.07,32.25 77.72,31.6 R15.2 | 77.81,25.3 R15.2 | U$6.41 103.48,27.08 102.6,27.08 94.51,27.08 v93.4,25.97 91.81,24.38 86.87,24.38 85.75,25.54 R15.2
  Bottom 0.152: IC11.29 93.74,25.63 v93.4,25.97
+3V3
  Top 0.305: 96.82,16.15 98.46,16.15 99.1,16.79 IC4.5 | 96.82,16.15 95.17,17.8 94.16,17.8 IC2.1 | C8.+ 96.42,13.91 96.82,14.31 96.83,14.32 96.83,15.24 | 96.82,16.15 96.82,15.24 96.83,15.24 | 96.83,15.24 91.95,15.24 90.98,14.28 90.98,11.38 91.44,10.92 91.5,10.86 X1.4
A0
  Bottom 0.152: IC1.19 69.07,41.53 73.55,37.04 76.95,37.04 78.03,35.97 78.21,35.79 IC11.12
A1
  Bottom 0.152: IC1.18 68.79,40.26 73.19,35.86 76.92,35.86 78.03,34.75 78.26,34.52 IC11.11
A2
  Bottom 0.152: IC1.17 68.55,38.99 73.04,34.49 77.06,34.49 78.03,33.53 78.31,33.25 IC11.10
A3
  Bottom 0.152: IC1.16 68.44,37.72 72.91,33.25 77.09,33.25 78.33,32 78.36,31.98 IC11.9
A4
  Bottom 0.152: IC1.15 67.24,36.45 71.76,31.93 77.13,31.93 78.35,30.71 IC11.8
A5
  Bottom 0.152: IC11.7 73.58,29.44 72.21,29.44 66.67,34.98 65.79,34.98 IC1.14
A6
  Bottom 0.152: IC11.6 74.24,28.17 72.26,28.17 66.75,33.68 65.81,33.68 IC1.13
A7
  Bottom 0.152: IC11.5 74.91,26.9 72.47,26.9 66.75,32.61 66.73,32.64 IC1.12
A8
  Bottom 0.152: IC11.28 98.75,26.9 101.58,29.72 103.38,29.72 U$6.37
A9
  Bottom 0.152: IC11.27 99.29,28.17 U$6.36
A10
  Top 0.152: IC5.49 76.14,44.03 76.14,43.95 82.75,37.34 102.56,37.34 103.33,36.58 103.33,34.85 U$6.35
  Bottom 0.152: IC11.26 98.7,29.44 101.5,32.23 103.35,32.23 U$6.35
A11  (via drill 0.33)
  Top 0.152: IC5.48 76.14,43.03 76.79,42.38 76.79,35.68 87.48,24.99 89,24.99 v89.61,25.6 97.54,33.53 99.36,33.53 U$6.34
  Bottom 0.152: IC11.3 82.42,24.38 88.39,24.38 v89.61,25.6
A12
  Bottom 0.152: IC11.25 97.23,30.71 101.27,34.75 103.33,34.75 U$6.33
A13  (via drill 0.33)
  Top 0.152: U$6.32 100.38,36.07 98.55,36.07 v88.09,25.6
  Bottom 0.152: v88.09,25.6 82.42,25.6 IC11.4
A14
  Bottom 0.152: IC11.23 97.41,33.25 101.5,37.34 103.38,37.34 U$6.31
A15
  Top 0.152: IC5.51 93.52,46.03 100.94,38.61 U$6.30
  Bottom 0.152: U$6.30 97.33,33.83 94.18,33.83 92.81,32.46 92.81,25.15 93.57,24.38 93.6,24.36 IC11.30
A16
  Bottom 0.152: IC11.31 96.75,23.09 U$6.38
A17
  Bottom 0.152: U$6.42 100.94,23.37 97.51,19.94 91.24,19.94 89.46,21.72 88.09,23.09 IC11.2
A18  (via drill 0.33)
  Top 0.152: IC6.9 38.16,39.68 38.71,40.23 39.12,40.64 v39.34,40.64
  Bottom 0.152: IC8.10 36.88,40.06 37.47,40.64 v39.34,40.64 50.02,40.64 IC9.10
A19  (via drill 0.33)
  Top 0.152: IC6.10 38.25,38.88 v38.73,39.37
  Bottom 0.152: IC8.9 36.88,38.79 37.47,39.37 v38.73,39.37 50.02,39.37 IC9.9
A20  (via drill 0.33)
  Top 0.152: IC6.11 38.66,38.08 v38.73,38.15
  Bottom 0.152: IC9.8 39.32,38.15 | 39.32,38.15 v38.73,38.15 | v38.73,38.15 37.52,38.15 36.83,37.47 35.49,37.47 IC8.8 | v38.73,38.15 39.32,38.15
A21  (via drill 0.33)
  Top 0.152: IC6.13 38.39,36.48 v38.73,36.83
  Bottom 0.152: IC8.7 36.88,36.25 37.47,36.83 v38.73,36.83 50.02,36.83 IC9.7
A22  (via drill 0.33)
  Top 0.152: IC6.14 38.64,35.68 v38.71,35.61
  Bottom 0.152: IC9.6 39.32,35.61 | 39.32,35.61 v38.71,35.61 | v38.71,35.61 37.52,35.61 36.83,34.92 35.49,34.92 IC8.6 | v38.71,35.61 39.32,35.61
A23  (via drill 0.33)
  Top 0.152: IC6.15 38.45,34.88 v39.04,34.29
  Bottom 0.152: IC8.5 36.88,33.71 37.47,34.29 v39.04,34.29 50.02,34.29 IC9.5
A24  (via drill 0.33)
  Top 0.152: IC6.16 38.28,34.08 v39.34,33.02
  Bottom 0.152: IC8.4 36.88,32.44 37.47,33.02 v39.34,33.02 50.02,33.02 IC9.4
A25  (via drill 0.33)
  Top 0.152: IC6.17 38.04,33.28 39.01,32.31 39.01,32.08 v39.34,31.75
  Bottom 0.152: IC8.3 36.88,31.17 37.47,31.75 v39.34,31.75 50.02,31.75 IC9.3
A26  (via drill 0.33)
  Top 0.152: v43.55,32.38 43.28,32.14 43.28,28.96 44.81,27.43 46.33,27.43 46.92,26.84 IC6.34
  Bottom 0.152: IC9.25 59.11,33.07 58.42,32.38 46.29,32.38 IC8.25 46.19,32.38 v43.55,32.38
A27  (via drill 0.33)
  Top 0.152: IC6.32 45.32,26.31 42.98,28.65 42.98,33.27 v43.24,33.66
  Bottom 0.152: IC9.24 59.11,34.34 58.42,33.66 46.29,33.66 IC8.24 46.19,33.66 v43.24,33.66
A28  (via drill 0.33)
  Top 0.152: IC6.29 42.92,26.27 42.06,27.13 42.06,37.12 v42.33,37.47
  Bottom 0.152: IC9.21 59.11,38.15 58.42,37.47 46.29,37.47 IC8.21 46.19,37.47 v42.33,37.47
A29  (via drill 0.33)
  Top 0.152: IC6.31 44.52,26.19 42.67,28.04 42.67,34.55 v42.94,34.92
  Bottom 0.152: IC9.23 59.11,35.61 58.42,34.92 46.29,34.92 IC8.23 46.19,34.92 v42.94,34.92
A30  (via drill 0.33)
  Top 0.152: IC6.18 37.93,32.48 38.71,31.7 38.71,31.11 v39.34,30.48
  Bottom 0.152: IC8.2 36.88,29.9 37.47,30.48 v39.34,30.48 50.02,30.48 IC9.2
A31  (via drill 0.33)
  Top 0.152: IC6.35 47.72,26.65 46.63,27.74 45.11,27.74 43.59,29.26 43.59,30.89 v43.85,31.11
  Bottom 0.152: IC9.26 59.11,31.8 58.42,31.11 46.29,31.11 IC8.26 | 46.19,31.11 IC8.26 | v43.85,31.11 46.19,31.11 | 46.19,31.11 IC8.26
A32  (via drill 0.33)
  Top 0.152: IC6.19 38.12,31.68 38.41,31.39 38.41,30.07 v38.58,29.9
  Bottom 0.152: IC8.1 36.88,28.63 37.47,29.21 38.73,29.21 | IC9.1 50.02,29.21 38.73,29.21 | 38.73,29.21 38.73,29.74 v38.58,29.9
A.REF
  Top 0.305: 25.12,25.62 20.85,25.62 18.34,23.11 18.34,18.69 18.34,17.63 C50.+ | 25.12,25.62 26.31,25.62 26.36,25.68 26.36,26.77 IC10.10 | 25.12,25.62 IC10.9
ALEFT
  Bottom 0.305: 13.96,30.09 13.06,30.99 C3.1 | 23.16,41.46 16.09,41.46 15.24,40.61 15.24,31.43 13.96,30.15 13.96,30.09 | 23.16,41.46 25.55,41.46 27.76,39.25 27.76,35.4 | IC7.7 27.76,35.4 | 26.49,35.36 26.49,34.7 IC7.6 | 26.49,35.36 26.49,35.4 23.95,35.4 23.9,35.36 C14.2 | 13.96,30.09 14.02,30.03 14.02,25.91 11.43,23.32 11.43,23.01 11.43,13.93 R4.2 11.36,8.6 11.89,8.08 11.89,2.09 C5.1 | 27.76,35.4 26.54,35.4 26.49,35.36 | R23.1 23.17,41.45 23.16,41.46
ARIGHT
  Bottom 0.305: 28.37,30.79 28.37,39.62 25.91,42.06 15.85,42.06 11.89,38.1 11.73,37.95 11.73,29.87 12.73,28.87 C4.1 12.73,26.76 12.5,26.52 5.94,19.96 5.94,14.03 R5.2 5.79,13.72 5.79,7.01 6.4,6.4 6.4,5.18 6.1,4.88 6.1,1.83 C6.1 6.1,1.92 | 28.37,30.79 28.07,30.48 27.74,30.48 27.74,28.82 IC7.2 27.76,27.23 27.51,26.98 25.91,26.98 | IC7.1 29.03,30.4 28.96,30.48 28.68,30.48 28.37,30.79 | C11.2 23.1,26.98 25.91,26.98 | R22.1 25.6,23.77 25.91,24.08 25.91,26.98
BCK  (via drill 0.33)
  Top 0.152: IC10.16 34.17,26.79 v35.05,25.91 | v49.07,27.13 51.82,27.13 53.03,28.35 53.17,28.48 IC6.42
  Bottom 0.152: v35.05,25.91 47.85,25.91 v49.07,27.13
BUF_CLK
  Top 0.152: X1.5 90.4,10.62 89.6,11.42 88.75,11.42 88.49,11.68 86.87,11.68 86.56,11.99 86.56,12.95 IC2.10
BUF_CS
  Top 0.152: IC2.15 92.89,11.73 93.7,10.92 X1.2 93.7,6.12 95.57,4.25 100.03,4.25 100.62,4.25 101.19,3.67 101.19,2.74 102.21,1.73 R6.1
BUF_DI
  Top 0.152: IC2.12 89.08,11.73 89.76,11.73 90.93,10.57 90.93,8.97 91.21,8.69 92.28,8.69 92.66,9.07 92.66,9.71 X1.3
BUF_LED
  Top 0.152: IC2.2 92.89,20.37 94.61,22.1 105.1,22.1 105.82,21.37 105.82,7.62 105.82,5.54 105.46,5.18 103.63,5.18 103.02,4.57 103.02,4.1 ACT.A
CD
  Top 0.152: X1.11 98.58,6.79 R3.2 98.97,6.4 102.41,6.4 103.48,7.47 103.48,7.79 103.48,13.7 103.48,14.58 U$6.49
CLK  (via drill 0.33)
  Top 0.152: IC2.3 91.62,18.16 89.92,16.46 87.17,16.46 85.34,14.63 85.34,13.06 IC2.9 85.27,11.05 v85.34,10.97
  Bottom 0.152: U$6.52 101.5,10.06 86.26,10.06 v85.34,10.97
CS  (via drill 0.33 pad 0.69)
  Top 0.152: IC2.14 91.62,14.22 91.85,14.46 v95.61,14.46
  Bottom 0.152: v95.61,14.46 102.55,14.46 103.48,13.52 103.48,12.71 103.48,11.84 U$6.53
D0  (via drill 0.33 pad 0.69)
  Top 0.152: v73.3,41.83 73.3,41.76 74.14,40.92 74.14,40.46 74.52,40.08 75.16,40.08 IC5.45
  Bottom 0.152: v73.3,41.83 73.61,41.53 IC1.2 78.26,41.53 78.64,41.15 80.19,39.6 IC11.15 88.06,39.6 88.09,39.62 97.23,48.77 U$6.22
D1  (via drill 0.33 pad 0.69)
  Top 0.152: IC5.44 74.51,39.03 73.69,39.85 73.38,40.16 v73.38,40.31
  Bottom 0.152: v73.38,40.31 75.59,40.31 IC1.3 78,40.26 78.33,39.93 79.93,38.33 IC11.14 87.4,38.33 87.48,38.41 96.62,47.55 103.02,47.55 104.24,48.77 U$6.23
D2  (via drill 0.33 pad 0.69)
  Top 0.152: IC5.43 74.59,38.03 74.07,38.56 v73.38,39.24
  Bottom 0.152: v73.38,39.24 73.64,38.99 IC1.4 77.44,38.99 77.72,38.71 79.38,37.06 IC11.13 88.57,37.06 97.54,46.02 97.74,46.23 U$6.24
D3  (via drill 0.33 pad 0.69)
  Top 0.152: IC5.42 74.45,37.03 v73.53,37.95
  Bottom 0.152: v73.53,37.95 73.84,37.64 75.56,37.64 IC1.5 76.96,37.72 78.33,36.35 88.47,36.35 92.66,40.54 92.99,40.87 IC11.17 97.18,40.87 101.19,44.88 103.3,44.88 U$6.25
D4  (via drill 0.33 pad 0.69)
  Top 0.152: IC5.41 74.14,36.03 v73.66,36.44
  Bottom 0.152: v73.66,36.44 75.58,36.51 IC1.6 76.94,36.45 78.33,35.05 87.78,35.05 92.05,39.32 92.33,39.6 IC11.18 98.02,39.6 U$6.26
D5  (via drill 0.33 pad 0.69)
  Top 0.152: v73.66,35.24 75,35.24 IC5.40
  Bottom 0.152: v73.66,35.24 73.72,35.18 IC1.7 76.99,35.18 78.33,33.83 87.17,33.83 91.44,38.1 91.67,38.33 IC11.19 97.38,38.33 101.42,42.37 103.33,42.37 U$6.27
D6  (via drill 0.33 pad 0.69)
  Top 0.152: IC5.39 73.65,34.03 v73.54,33.92
  Bottom 0.152: v73.54,33.92 74.38,33.92 74.4,33.91 IC1.8 77.04,33.91 78.33,32.61 86.56,32.61 90.83,36.88 91.01,37.06 IC11.20 98.02,37.06 U$6.28
D7  (via drill 0.33 pad 0.69)
  Top 0.152: IC5.38 74.28,33.03 73.94,32.68 v73.76,32.68
  Bottom 0.152: v73.76,32.68 73.81,32.64 IC1.9 77.09,32.64 77.11,32.61 78.33,31.39 85.95,31.39 90.22,35.66 90.35,35.79 IC11.21 97.51,35.79 101.58,39.85 103.35,39.85 U$6.29
D8  (via drill 0.33)
  Top 0.152: IC6.8 38.04,40.48 39.01,41.45 39.34,41.78 v39.34,41.91
  Bottom 0.152: IC8.11 36.88,41.33 37.47,41.91 v39.34,41.91 50.02,41.91 IC9.11
D9  (via drill 0.33)
  Top 0.152: IC6.7 38.23,41.28 38.71,41.76 38.71,42.85 v39.04,43.18
  Bottom 0.152: IC8.12 36.88,42.6 37.47,43.18 v39.04,43.18 50.02,43.18 IC9.12
D10  (via drill 0.33)
  Top 0.152: IC6.6 38.12,42.08 38.41,42.37 38.41,44.12 v38.73,44.45
  Bottom 0.152: IC8.13 36.88,43.87 37.47,44.45 v38.73,44.45 50.02,44.45 IC9.13
D11  (via drill 0.33)
  Top 0.152: IC6.22 39.64,29.28 39.93,29.57 39.93,44.68 v40.34,45.09
  Bottom 0.152: IC9.15 60.82,45.72 59.05,45.72 58.47,45.14 IC8.15 46.19,45.09 v40.34,45.09
D12  (via drill 0.33)
  Top 0.152: IC6.23 39.45,28.48 40.23,29.26 40.23,43.54 v40.5,43.81
  Bottom 0.152: IC9.16 60.82,44.45 59.05,44.45 58.47,43.87 IC8.16 46.19,43.81 v40.5,43.81
D13  (via drill 0.33)
  Top 0.152: IC6.24 39.26,27.68 40.54,28.96 40.54,42.26 v40.8,42.55
  Bottom 0.152: IC9.17 59.11,43.23 58.42,42.55 46.29,42.55 IC8.17 46.19,42.55 v40.8,42.55
D14  (via drill 0.33)
  Top 0.152: IC6.25 39.72,27.53 40.84,28.65 40.84,40.95 v41.11,41.27
  Bottom 0.152: IC9.18 59.11,41.96 58.42,41.27 46.29,41.27 IC8.18 46.19,41.27 v41.11,41.27
D15  (via drill 0.33)
  Top 0.152: IC6.26 40.52,27.72 41.15,28.35 41.15,39.68 v41.41,40.01
  Bottom 0.152: IC9.19 59.11,40.69 58.42,40.01 46.29,40.01 IC8.19 46.19,40.01 v41.41,40.01
DI  (via drill 0.33 pad 0.69)
  Top 0.152: v96.06,15.92 89.51,15.92 87.81,14.22 IC2.11
  Bottom 0.152: v96.06,15.92 97.06,16.92 102.61,16.92 103.48,16.05 103.48,15.25 103.48,14.38 U$6.51
DO  (via drill 0.33)
  Top 0.152: v88.16,10.92 88.2,10.78 X1.7
  Bottom 0.152: U$6.50 99.82,10.92 v88.16,10.92
DOWN
  Top 0.152: U$6.A13 93.27,1.83 66.11,1.83 65.28,2.67 65.28,3.44 62.85,5.87 54.28,5.87 DOWN.4 DOWN.3
  Bottom 0.152: DOWN.3 46.02,6.86 R11.2
DSP_A0
  Top 0.152: IC6.60 55.15,42.88 56,42.03 IC5.5
DSP_A1
  Top 0.152: IC6.61 55.15,43.68 55.8,43.03 IC5.4
DSP_A2
  Top 0.152: IC5.3 57.28,44.03 56.83,44.48 IC6.62
DSP_A3
  Top 0.152: IC5.2 57.28,45.03 57.03,45.28 IC6.63
DSP_A4
  Top 0.152: IC5.1 57.28,46.03 57.23,46.08 IC6.64
DSP_A5
  Top 0.152: IC6.65 51.87,48.53 IC5.64
DSP_A6
  Top 0.152: IC5.63 61.71,49.46 51.07,49.46 50.92,49.31 IC6.66
DSP_A7
  Top 0.152: IC5.62 62.71,49.46 62.37,49.8 50.94,49.8 50.45,49.31 50.12,49.31 IC6.67
DSP_A8
  Top 0.152: IC5.61 63.71,49.46 63.03,50.14 50.71,50.14 50.18,49.61 49.62,49.61 49.32,49.31 IC6.68
DSP_A9
  Top 0.152: IC6.69 48.52,47.45 52.14,47.45 52.81,48.12 59.77,48.12 60.29,47.6 64.71,47.6 IC5.60
DSP_A10
  Top 0.152: IC6.70 47.72,47.45 48.05,47.12 52.25,47.12 52.94,47.81 59.65,47.81 60.19,47.27 65.39,47.27 65.71,47.6 IC5.59
DSP_A11
  Top 0.152: IC5.56 68.71,47.01 68.19,46.49 60.54,46.49 59.52,47.51 53.06,47.51 52.37,46.82 47.55,46.82 46.92,47.45 IC6.71
DSP_A12
  Top 0.152: IC6.72 46.12,47.45 47.08,46.5 52.48,46.5 53.19,47.2 59.4,47.2 60.41,46.19 68.32,46.19 69.71,47.58 69.71,47.6 IC5.55
DSP_A13
  Top 0.152: IC6.74 44.52,47.42 45.75,46.19 52.6,46.19 53.31,46.9 59.27,46.9 60.28,45.88 69,45.88 70.71,47.6 IC5.54
DSP_A14
  Top 0.152: IC5.53 71.71,47.6 69.69,45.58 60.12,45.58 59.14,46.56 53.42,46.56 52.74,45.88 45.29,45.88 43.72,47.45 IC6.75
DSP_A15
  Top 0.152: IC5.52 72.71,49.46 69.21,49.46 66.22,49.46 65.3,50.37 65.3,51.97 64.79,52.48 52.61,52.48 50.05,49.92 43.53,49.92 42.92,49.31 IC6.76
DSP_CPUK
  Top 0.152: IC5.16 57.28,31.03 57.28,31.15 55.15,33.28 IC6.48
DSP_D0
  Top 0.152: IC6.51 55.15,35.68 56.8,34.03 IC5.13
DSP_D1
  Top 0.152: IC5.12 57.28,35.03 57.28,35.15 55.15,37.28 IC6.53
DSP_D2
  Top 0.152: IC6.54 55.15,38.08 57.2,36.03 IC5.11
DSP_D3
  Top 0.152: IC6.55 55.15,38.88 57,37.03 IC5.10
DSP_D4
  Top 0.152: IC6.56 55.15,39.68 56.8,38.03 IC5.9
DSP_D5
  Top 0.152: IC6.57 55.15,40.48 56.6,39.03 IC5.8
DSP_D6
  Top 0.152: IC6.58 55.15,41.28 56.4,40.03 IC5.7
DSP_D7
  Top 0.152: IC6.59 55.15,42.08 56.2,41.03 IC5.6
DSP_PD2
  Top 0.152: IC6.49 55.15,34.08 57.2,32.03 IC5.15
DSP_PD3
  Top 0.152: IC6.50 55.15,34.88 57,33.03 IC5.14
GND  (via drill 0.33 pad 0.69)
  Top 0.305: IC10.14 31.47,26.88 31.47,28.2 32.74,29.47 32.74,34.59 | 24.2,33.92 23.91,34.2 C22.1 21.8,34.2 21.61,34.4 | 24.22,29.02 24.22,28.2 28.82,28.2 28.93,28.09 IC10.12 | 32.74,34.59 IC10.2 | 32.74,34.59 34.01,34.59 IC10.1 | IC4.2 98.15,19.39 98.73,19.39 99.68,18.44 99.68,14.42 99.17,13.91 C8.- | IC3.4 15.93,43.55 v15.56,43.18 | v14.1,53.26 14.02,53.19 C24.2 | 95.45,8.99 95.3,8.84 95.1,8.64
  Bottom 0.305: 25,29.02 IC7.4 | U$6.GND... U$6.GND.... | v15.56,43.18 16.19,43.18
  other vias: 24.2,29.32 66.19,47.09 99.26,15.37 80.37,44.14 80.26,42.58 97.82,11.63 97.51,5.5 43.81,11.75 24.31,50.9 98.12,17.73 96.29,17.81 60.62,26.88 61.69,26.88 62.76,26.88 79.14,48.06 81.27,48.06 83.41,48.06 85.85,48.06 37.99,26.65 38.91,26.65 73.73,30.23 73.73,31.15 72.82,30.23 72.82,31.15 71.9,31.15 70.07,32.67 69.46,33.28 68.85,33.89 68.24,34.5 67.64,35.11 73.85,45.02 73.39,45.78 72.13,43.19 71.22,43.19 67.56,44.41 66.64,44.41 65.73,44.41 73.05,43.19 72.93,45.02 44.24,45.87 43.33,45.87 43.33,46.78 32.35,33.07 33.27,32.76 33.27,33.68 32.35,33.98 37.08,26.65 60.93,20.17 62.15,20.17 63.37,20.17 94.77,8.24
  pour Top: 10.52,33.17 10.52,47.96 16.76,47.96 16.76,43.84 15.24,43.84 15.24,46.58 14.17,46.58 14.17,33.17
  pour Bottom (isolate 0.203): 0,53.85 107.82,53.85 107.82,0.51 0,0.51
  pour Top (isolate 0.203): 0,54.36 9.09,54.36 9.09,31.34 18.72,31.34 18.72,53.21 10.87,53.21 10.87,54.36 107.82,54.36 107.82,0 0,0
L1
  Bottom 0.305: R20.2 R19.2 18.98,37.62 C12.1
L2
  Bottom 0.305: R19.1 16.98,37.36 R21.2 C14.1
L3
  Bottom 0.305: IC7.5 25.22,32.59 20.42,32.59 19.79,33.22 C13.2 16.98,35.22 R21.1
L.OUT  (via drill 0.33 pad 0.69)
  Top 0.305: IC10.11 27.66,25.39 27.08,24.81 v25.12,24.81
  Bottom 0.305: v25.12,24.81 25.12,25.17 24.38,25.91 R16.2
LCD_D0
  Top 0.152: U$6.A7 71.47,8.29 51.98,8.29 50.35,9.92 50.35,12.14 47.85,14.63 45.26,14.63 41.3,18.59 38.71,18.59 38.41,18.9 38.41,20.78 JP1.8
LCD_D1
  Top 0.152: U$6.A6 69.36,7.86 51.98,7.86 49.88,9.96 49.88,11.71 49.88,12 47.55,14.33 45.11,14.33 41.15,18.29 36.88,18.29 35.97,19.2 35.97,20.68 JP1.7
LCD_D2
  Top 0.152: U$6.A5 67.12,7.55 51.85,7.55 49.57,9.83 49.57,11.58 47.26,13.89 45.46,13.89 45.09,13.89 41,17.98 35.05,17.98 33.22,19.81 33.22,20.78 JP1.6
LCD_D3
  Top 0.152: U$6.A4 64.89,7.25 51.69,7.25 49.14,9.79 49.14,11.56 47.2,13.49 45.43,13.49 45.03,13.49 40.84,17.68 33.22,17.68 32.92,17.98 30.73,20.17 JP1.5
LCD_D4
  Top 0.152: U$6.A3 62.74,6.86 47.17,6.86 36.25,6.86 28.19,14.91 JP1.4
LCD_D5
  Top 0.152: U$6.A2 62.23,4.83 37.73,4.83 25.65,16.91 JP1.3
LCD_D6
  Top 0.152: U$6.A1 59.99,4.52 37.61,4.52 23.11,19.01 JP1.2
LCD_D7
  Top 0.152: U$6.A0 57.76,4.22 37.46,4.22 20.85,20.83 JP1.1
LCD_E
  Top 0.152: U$6.A8 80.18,3.05 72.82,10.41 55.01,10.41 53.95,9.35 51.34,9.35 50.77,9.92 50.77,12.32 48.16,14.94 45.41,14.94 41.45,18.9 40.84,19.51 40.84,20.78 JP1.9
LCD_R!W
  Top 0.152: U$6.A9 82.14,5.24 78.42,5.24 71.39,12.27 67.79,12.27 61.92,18.21 48.23,18.21 47.55,18.9 44.81,18.9 43.59,20.12 43.59,20.68 JP1.10
LCD_RS
  Top 0.152: U$6.A10 77.64,12.27 75.15,12.27 68.8,18.55 48.51,18.55 46.63,20.42 46.38,20.42 JP1.11
LE
  Bottom 0.152: IC1.11 67.39,31.37 67.67,31.09 72.54,26.21 73.3,26.21 90.3,26.21 91.59,24.92 94.03,22.48 96.77,22.48 101.42,27.13 103.33,27.13 U$6.39
LEFT
  Top 0.152: LEFT.4 LEFT.3
  Bottom 0.152: U$6.A11 85.6,6.86 52.92,6.86 50.41,9.37 44.18,9.37 44.12,9.42 LEFT.4 | LEFT.3 35.87,10.04 R13.2
LRCK  (via drill 0.33, 0.33 pad 0.69)
  Top 0.152: IC10.13 30.2,25.33 v31.26,24.27 | IC6.43 52.78,29.28 v52.7,29.21
  Bottom 0.152: v31.26,24.27 47.95,24.27 52.7,29.02 v52.7,29.21
N$1
  Top 0.152: AVR.4 AVR.3
  Bottom 0.152: U$6.RESET 39.84,4.35 35.09,4.35 31.14,4.35 AVR.3
N$2
  Bottom 0.305: C3.2 10.88,31.66 9.84,32.7 9.84,43.29 U$4.PSIG
N$3
  Bottom 0.305: U$5.PSIG 9.78,28.75 C4.2
N$4
  Bottom 0.305: C5.2 U$3.LEFT
N$8
  Bottom 0.305: C6.2 4.54,2.12 U$3.RIGHT
N$9
  Bottom 0.305: R4.1 9.36,14.4 U$2.LEFT
N$10
  Bottom 0.305: R5.1 4.14,14.72 U$2.RIGHT
N$11
  Top 0.152: R6.2 105.14,4.01 ACT.C
N$13
  Top 0.305: TM1.S 67.46,19.93 66.53,19 50.34,19 JP1.12
N$15  (via drill 0.33)
  Top 0.305: IC3.3 14.66,42.65 14.94,42.37 23.47,42.37 v25.91,44.81
  Bottom 0.305: v25.91,44.81 25.91,46.16 BAT.+$1
N$21
  Top 0.152: IC3.1 12.12,44.13 12.02,44.03 12.02,42.23 Q1.2
N$22
  Top 0.152: Q1.1 13.29,43.71 13.39,43.8 IC3.2
PWM
  Bottom 0.152: JP1.15 56.13,19.46 57,18.59 101.8,18.59 U$6.46
R1
  Bottom 0.305: C9.2 16.98,23.91 R17.2 R16.1
R2
  Bottom 0.305: R17.1 16.98,26.82 17.12,26.96 18.73,26.96 18.9,27.13 18.9,27.96 R18.2 C11.1
R3
  Bottom 0.305: IC7.3 26.49,30.2 20.91,30.2 19.01,30.2 C10.2 18.67,29.86 18.67,29.72 16.99,28.04 R18.1
R.OUT  (via drill 0.33 pad 0.69)
  Top 0.305: v26.79,38.57 27.66,37.7 IC10.6
  Bottom 0.305: R20.1 25.71,37.49 v26.79,38.57
RIGHT
  Bottom 0.152: RIGHT.3 57.61,9.42 | 57.61,9.42 57.94,9.42 RIGHT.4 64.19,7.92 92.05,7.92 96.93,3.05 U$6.A14 | R10.2 57.67,9.49 57.61,9.42
RST  (via drill 0.33 pad 0.69)
  Top 0.152: IC6.47 55.15,32.48 56.66,30.97 v56.66,28.77 56.69,28.73 56.69,27.74 57.3,27.13 58.22,27.13 58.83,26.52 | 75.19,32 IC5.37 64.34,32.03 58.83,26.52 | 58.83,26.52 59.44,25.91 59.44,24.99 60.73,23.7 63.09,21.34 63.4,21.03 76.5,21.03 77.72,21.03 92.89,21.03 96.47,24.61 103.4,24.61 U$6.43
  Top 0.305: APU.4 APU.3
  Bottom 0.152: v56.66,28.77 55.14,28.77 54.61,28.23 49.86,23.48 31.2,23.48 29.46,21.75 29.46,16.66 29.46,12.34 27.92,10.79 23.5,10.79 22.12,9.42 APU.4 22.12,6.99 21.27,6.13 R2.2
SCL
  Top 0.152: R9.2 18.1,50.86 16.56,49.33 14.66,49.33 IC3.6 14.66,51.99 15.81,53.14 92.66,53.14 U$6.21
SDA
  Top 0.152: IC3.5 15.93,51.99 21.93,51.99 22.17,51.74 | 22.17,51.74 22.17,51.66 R8.1 | U$6.20 90.42,52.84 23.27,52.84 22.17,51.74
SELECT
  Bottom 0.152: 99.15,3.05 U$6.A15 99.06,3.05 93.57,8.53 77.29,8.53 SELECT.4 SELECT.3 69.57,9.75 R7.2
SO  (via drill 0.33)
  Top 0.152: IC6.44 52.62,30.08 v50.8,28.26 | v32.7,25.08 32.7,26.76 IC10.15
  Bottom 0.152: v50.8,28.26 50.8,27.62 48.26,25.08 v32.7,25.08
UP
  Bottom 0.152: 48.78,13.19 48.5,13.19 47.78,12.47 UP.3 | 48.78,13.19 50.05,13.19 50.77,12.47 UP.4 52.61,12.47 54.34,10.75 54.34,9.1 56.04,7.4 87.6,7.4 U$6.A12 | R12.2 48.63,13.35 48.78,13.19
VCC  (via drill 0.33, 0.33 pad 0.69)
  Top 0.305: IC5.57 67.71,47.52 67.92,47.32 v67.92,47.06 | IC6.73 45.32,47.38 45.38,47.38 v45.67,47.09 | 32.78,41.69 | 32.78,41.69 32.78,40.9 31.47,39.59 IC10.3 31.47,34.59 31.3,34.59 31.28,34.57 | 31.09,44.41 32.78,42.72 32.78,41.69 | v31.28,32.29 31.28,34.57 | IC10.4 30.2,34.59 31.26,34.59 31.28,34.57 | 31.09,44.41 31.79,45.11 31.79,48.22 30.99,49.01 R8.2 R9.1 19.95,48.92 18.74,48.92 12.45,48.92 12.12,49.25 IC3.8 10.86,51.91 C24.1 | 31.09,44.41 30.02,43.34 C51.+ 29.19,41.88 26.14,38.83 26.14,37.65 | 26.14,37.65 26.39,37.4 IC10.7 | U$6.5V.. U$6.5V. | TM1.A 74.37,22.47 R14.1 R15.1 | R3.1 98.84,8.23 99.97,8.23 100.47,8.73 100.47,18.92 IC4.1 99.06,20.34 99.06,21.26 98.83,21.49 v98.22,21.49 97.46,21.49 97.27,21.3 | IC4.3 97.2,21.22 97.27,21.3 | C22.2 22.86,36.88 23.47,37.49 24.99,37.49 | 24.99,37.49 25.98,37.49 26.14,37.65 | IC10.8 25.12,37.36 24.99,37.49 | IC5.50 76.55,45.03 v76.77,44.8 | C1.1 95.96,21.3 97.27,21.3 | v46.04,26.67 46.12,26.59 IC6.33 C17.1 48.41,23.47 JP1.13 | C16.1 32.93,41.84 32.78,41.69
  Bottom 0.305: 63.84,29.26 63.84,28.96 63.84,28.63 70,22.47 TM1.A 79.92,22.47 81.15,23.7 92.13,23.7 93.95,21.87 94,21.82 IC11.32 97.89,21.82 v98.22,21.49 101.38,24.65 105.39,24.65 106.07,25.34 106.07,49.68 104.65,51.1 U$6.5V.. | 63.84,29.26 63.84,42.38 64.26,42.8 | 46.01,3.54 43.49,6.07 40.63,6.07 40.63,6.13 39.73,7.03 39.73,8.23 | 39.73,11.58 39.73,8.23 | 46.01,3.54 49.36,6.89 49.36,7.28 R11.1 | U$6.5V 46.23,3.33 46.01,3.54 | 49.09,17.03 50.38,15.74 50.48,15.74 R12.1 51.44,14.69 51.78,15.03 57.4,15.03 59.52,12.9 R10.1 63.46,11.73 R7.1 | 49.09,17.03 47.98,15.93 46.62,15.93 42.28,11.58 40.21,11.58 39.73,11.58 | 49.09,17.03 51.05,19 JP1.13 52.88,22.66 53.07,22.66 59.67,29.26 59.74,29.26 IC9.28 63.84,29.26 | R13.1 39.73,11.58 | 64.15,43.96 64.26,43.84 64.26,42.8 | 64.26,42.8 IC1.20 67.79,42.8 67.97,42.98 69.66,44.67 C7.2 | C23.1 64.15,43.96 | 33.22,29.09 31.28,31.03 v31.28,32.29 | 33.22,29.09 33.22,28.85 34.05,28.02 44.23,28.02 44.84,28.63 46.03,28.63 IC8.28 46.04,28.42 v46.04,26.67 | C15.1 33.22,29.09 | IC7.8 29.03,41.13 29.79,41.88 C51.+ | 64.15,43.96 64.39,44.2 64.39,46.1 64.39,46.74 63.5,47.62 48.9,47.62 48.4,47.13 45.71,47.13 v45.67,47.09 45.81,47.23 C19.1 | 39.73,8.23 31.09,8.23 27.3,4.45 20.23,4.45 R2.1 | U$6.5V. 98.25,51.31 90.83,43.89 90.63,43.69 C2.2 89.85,44.57 89.31,45.11 77.08,45.11 v76.77,44.8 76.11,44.14 70.73,44.14 70.16,44.14 70.1,44.2 69.66,44.64 C7.2 | 69.49,45.38 C7.2 | C18.1 67.92,48.32 v67.92,47.06 68.45,47.06 69.49,46.02 69.49,45.38 | 69.49,45.38 C7.2
XTAL1
  Top 0.305: C21.2 54.56,25.6 53.34,25.6 X2.1 | IC6.45 54.25,30.86 55.32,30.86 55.4,30.79 55.4,27.28 55.4,27.2 54.79,26.59 C21.2 | 54.94,25.68 C21.2
XTAL2
  Top 0.305: X2.2 58.22,25.6 57,25.6 C20.2 56.62,25.68 56.62,26.75 56.54,26.82 55.85,27.51 55.85,31.17 55.32,31.7 54.25,31.7 IC6.46

### Text on the board
tPlace: WHITE | APU Mega Shield / With integrated APU / Rev 1.04 / Dec 17, 2015 / / Designed by / CaitSith2 | RED | D7 | D6 | D5 | D4 | D3 | D2 | D1 | D0 | E | R!W | RS | v0 | Vcc | Gnd | L+ | L- | HEADPHONE | Micro SD | LINEOUT